# EAGLE design OPBS-Dynamo (EAGLE 6.4)
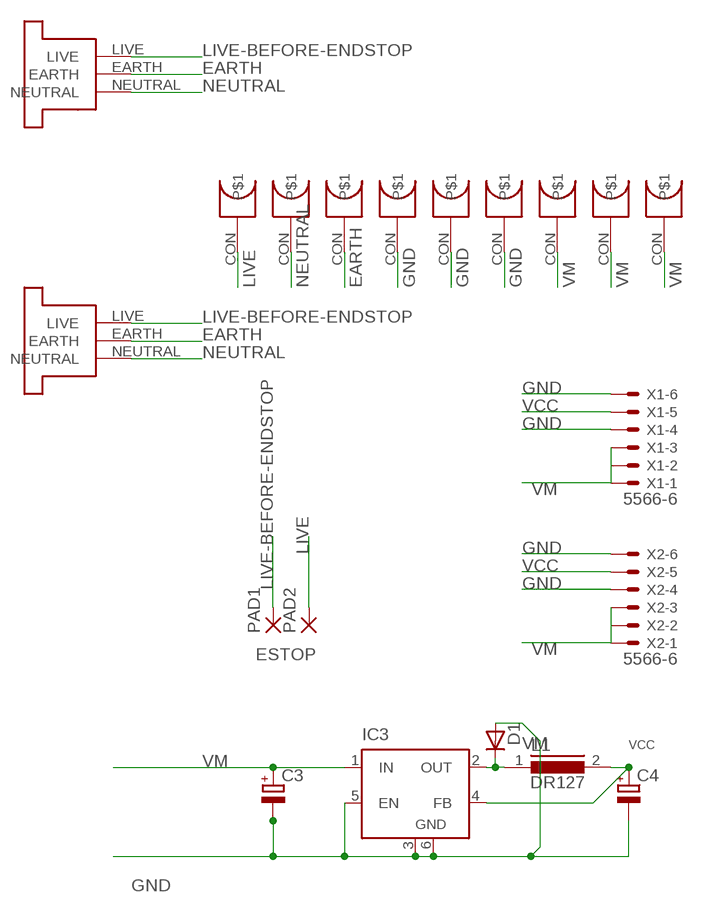
[diagram p0: schematic, sheet 1]

## Parts
C3  CPOL-EUE  [PANASONIC_E]
C4  CPOL-EUE  [PANASONIC_E]
D1  D-SOD-87  [SOD87]
EARTH  SLIDEINSCREW9.53  [SLIDEINSCREW]
GND1  SLIDEINSCREW9.53  [SLIDEINSCREW]
GND2  SLIDEINSCREW9.53  [SLIDEINSCREW]
GND3  SLIDEINSCREW9.53  [SLIDEINSCREW]
IC3  LM2596S  [TO263-5]
L1  DR127  [DR127]
LIVE  SLIDEINSCREW9.53  [SLIDEINSCREW]
NEUTRAL  SLIDEINSCREW9.53  [SLIDEINSCREW]
PAD1  3,81/1,4  [3,81/1,4]
PAD2  3,81/1,4  [3,81/1,4]
U$1  IEC320JR-101S  [IEC320-JR101S]
U$2  IEC320JR-101S  [IEC320-JR101S]
V1  SLIDEINSCREW9.53  [SLIDEINSCREW]
V2  SLIDEINSCREW9.53  [SLIDEINSCREW]
V3  SLIDEINSCREW9.53  [SLIDEINSCREW]
X1  5566-6  [5566-6]
X2  5566-6  [5566-6]

## Nets
EARTH: EARTH.CON U$1.EARTH U$2.EARTH
GND: C3.- C4.- D1.2(A) GND1.CON GND2.CON GND3.CON IC3.3(GND) IC3.5(EN) IC3.6(GND) X1.4 X1.6 X2.4 X2.6
LIVE: LIVE.CON PAD2.1(P)
LIVE-BEFORE-ENDSTOP: PAD1.1(P) U$1.LIVE U$2.LIVE
N$4: D1.1(C) IC3.2(OUT) L1.1
NEUTRAL: NEUTRAL.CON U$1.NEUTRAL U$2.NEUTRAL
VCC: C4.+ IC3.4(FB) L1.2 X1.5 X2.5
VM: C3.+ IC3.1(IN) V1.CON V2.CON V3.CON X1.1 X1.2 X1.3 X2.1 X2.2 X2.3

## Notes on the sheet
- ESTOP

## Library data of the parts
C3 C4 = resistor:CPOL-EU: POLARIZED CAPACITOR, European symbol
D1 = semicon-smd-ipc:D-: DIODE unfilled
EARTH GND1-GND3 LIVE NEUTRAL V1-V3 = PSUBoard-IECPlug:SLIDEINSCREW9.53
IC3 = linear:LM2596S: STEP-DOWN VOLTAGE REGULATOR
L1 = inductors:DR127: High Power Density, High Efficiency, Shielded Inductors Source: coiltronics_dr_series.pdf
PAD1 PAD2 = wirepad:3,81/1,4: THROUGH-HOLE PAD
U$1 U$2 = PSUBoard-IECPlug:IEC320JR-101S
X1 X2 = con-molex:5566-6: Mini FIT connector 6 pol Source: http://www.molex.com; MPN: 95566-61002; OC_FARNELL: unknown; OC_NEWARK: 22K8620

## Net classes
0 default: width 0.203 mm, drill 0.406 mm, clearance 0.203 mm

## Board
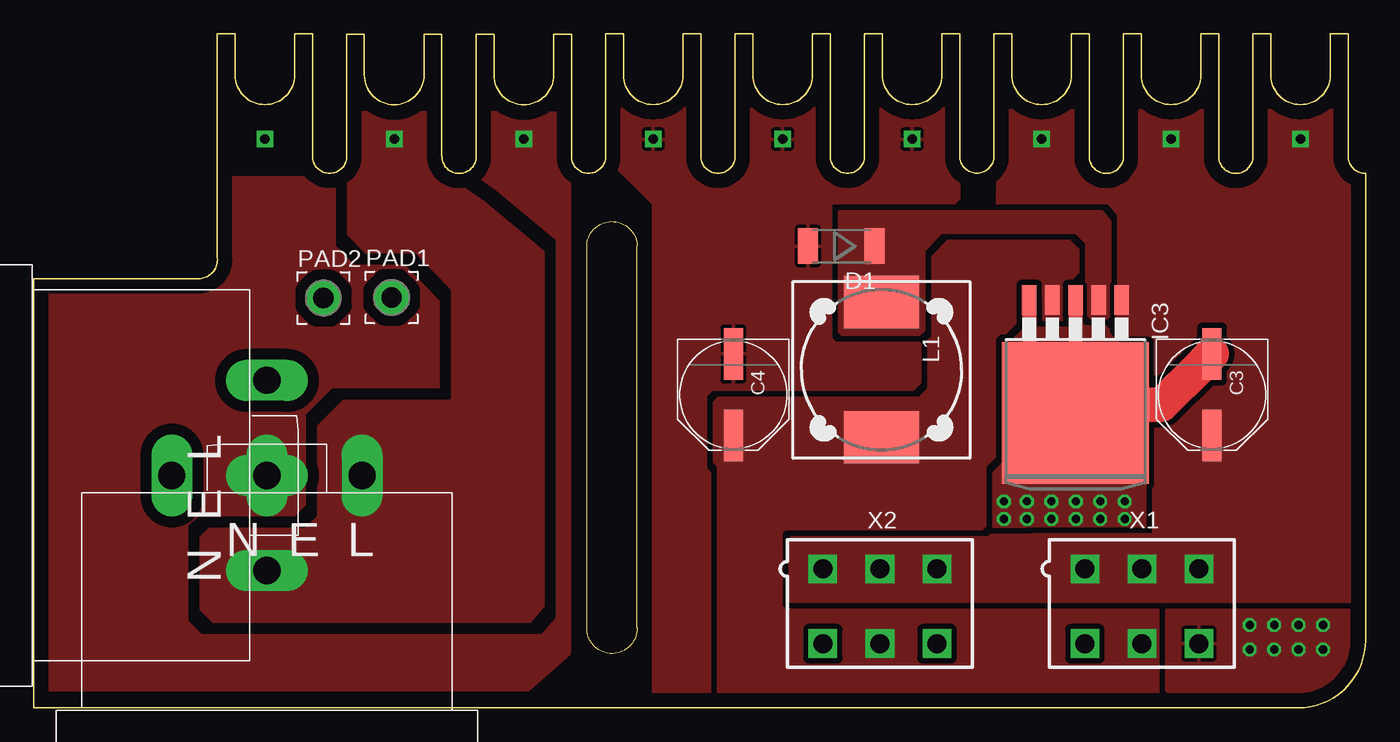
[diagram p1: board, top side]
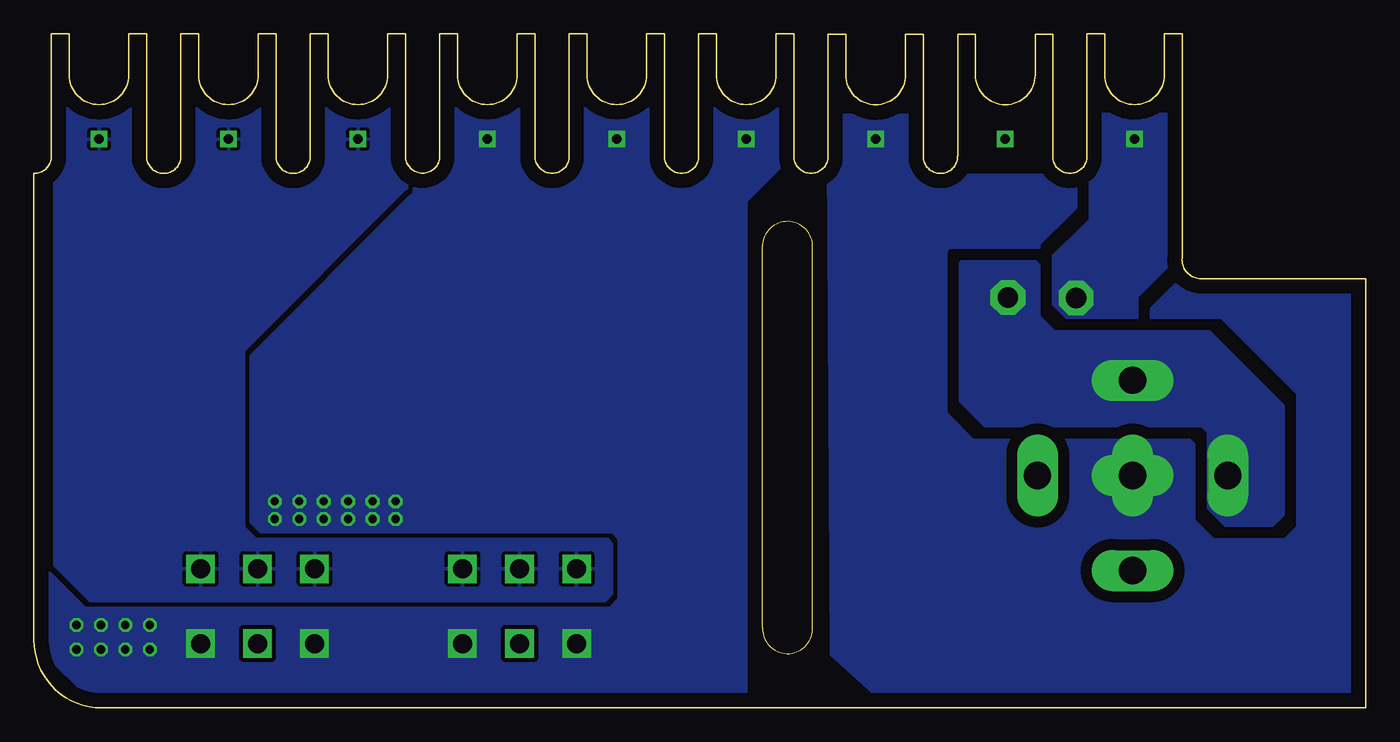
[diagram p2: board, bottom side, seen from below]

Size 98.03 x 49.6 mm. Coordinates in mm from the lower left corner, seen from the top.
Outline: 23.03,40.61 arc-180 20.5,40.61
Outline: 32.56,40.6 arc-180 30.03,40.6
Outline: 42.09,40.61 arc-180 39.56,40.61
Outline: 51.62,40.61 arc-180 49.09,40.61
Outline: 61.15,40.61 arc-180 58.62,40.61
Outline: 70.68,40.62 arc-180 68.15,40.62
Outline: 80.21,40.6 arc-180 77.68,40.6
Outline: 89.74,40.6 arc-180 87.21,40.6
Outline: 96.74,40.6 arc90 98.03,39.34 98.03,5 arc-90 93.06,0 0,0 0,31.6 12.24,31.6 arc90 13.5,33.13
Outline: 13.5,40.6 13.5,33.14
Outline: 40.7,33.9 arc-180 44.4,34 44.4,5.9 arc-180 40.7,5.8 40.7,33.9
Copper layers (1*16): Top 0.035mm / dielectric 1.5mm / Bottom 0.035mm
Design rules "default": minimum track width 10mil, minimum drill 24mil, track to track 8mil, track to pad 8mil, pad to pad 8mil, via to via 8mil, smd to smd 8mil, copper to edge 40mil, drill to drill 8mil, minimum pad ring 10mil, minimum via ring 8mil, stop-mask expansion 4mil, vias tented up to drill 0mil, thermal gap 10mil

### Footprints (pad centres in the part's own frame; a part is rotated, then mirrored left to right if it is on the bottom)
PANASONIC_E = smd 3.8 x 1.4: + 3,0; - -3,0
SOD87 = smd 1.45 x 2.6: 1 -2.445,0; 2 2.445,0
SLIDEINSCREW = drill 0.7 square: CON 0,-1.27
TO263-5 = smd 1.067 x 2.159: 1 -3.404,-5.791; 2 -1.702,-5.791; 3 0,-5.791; 4 1.702,-5.791; 5 3.404,-5.791 | smd 10.8 x 10.41: 6 0,2.54
DR127 = smd 3.85 x 5.5: 1 -4.975,0; 2 4.975,0
3,81/1,4 = drill 1.5 pad 2.54 octagon: 1 0,0
IEC320-JR101S = drill 2 long: EARTH 0,0; LIVE 7,0; NEUTRAL -7,0
5566-6 = drill 1.4 square: 1 4.2,-2.75; 2 0,-2.75; 3 -4.2,-2.75; 4 4.2,2.75; 5 0,2.75; 6 -4.2,2.75

### Placement (x,y rotation side)
C3  86.73,23.05 270 top
C4  51.49,23.05 270 top
D1  59.43,33.99 180 top
EARTH  36.06,40.59 180 top
GND1  45.59,40.6 180 top
GND2  55.12,40.6 180 top
GND3  64.65,40.6 180 top
IC3  76.67,24.24 180 top
L1  62.39,24.89 270 top
LIVE  17,40.6 180 top
NEUTRAL  26.52,40.59 180 top
PAD1  26.33,30.21 0 top
PAD2  21.31,30.16 0 top
U$1  17.15,17.11 90 top
U$2  17.15,17.11 180 top
V1  74.18,40.6 180 top
V2  83.71,40.6 180 top
V3  93.24,40.6 180 top
X1  81.57,7.49 180 top
X2  62.28,7.48 180 top

### Tracks (layer width: path | path; a pad name or v marks a point on that pad's centre or on a via)
EARTH
  pour Bottom (isolate 0.813, rank 3, no thermals): 12.45,31.58 13.56,32.69 13.52,39.28 32.85,39.28 32.85,43.55 33.01,43.71 39.18,43.71 39.37,43.52 39.6,40.53 39.4,3.9 35.1,0 0,0 0,31.58
  pour Top (isolate 0.813, rank 5, no thermals): 32.47,43.92 31.5,43.92 31.5,39.1 2.51,39.1 2.51,39.03 0.05,38.05 -0.33,1.26 36.4,1.26 39.5,4 39.5,43.45 39.4,43.85
GND  (via drill 0.6)
  Top 1.016: IC3.3 76.67,22.4 IC3.6 73.27,25.1 IC3.5
  Top 2.54: C3.- 85.93,25.23 83,22.3 76.77,22.3 76.67,22.4
  other vias: 71.4,15.2 73.1,15.2 74.9,15.2 76.7,15.2 78.5,15.2 80.3,15.2 71.4,13.9 73.1,13.9 74.9,13.9 76.7,13.9 78.5,13.9 80.3,13.9 89.5,6.1 91.3,6.1 93.1,6.1 94.9,6.1 94.9,4.3 93.1,4.3 91.3,4.3 89.5,4.3
  pour Bottom (isolate 0.305, rank 6, no thermals): 42.1,49.7 42.1,40.8 45.2,37.7 45.6,37.3 45.6,0.3 93.5,0.3 97.7,4.5 97.7,38.8 96.5,40 68.5,40 68,40.5 68,49.7
  pour Top (isolate 0.406, rank 3): 68.1,49.5 68.1,37.5 67.6,37 59.1,37 58.8,36.7 58.8,27.5 59.3,27 65,27 65.4,26.6 65.4,23.8 64.9,23.3 50.2,23.3 49.6,22.7 49.6,17.8 49.9,17.5 49.9,1.2 45.6,1.2 45.6,37.1 42.2,40.5 42.2,49.6 68,49.6
  pour Top (isolate 0.406, rank 6, no thermals): 70.5,13.3 81.9,13.3 81.9,26.7 81.8,26.8 80.1,26.8 78.9,28 77.7,28 77.3,28.4 77.2,28.5 77.2,31 77.1,31.1 76.2,31.1 76.1,31 76.1,28.4 75.9,28.2 74,28.2 73.8,28.4 73.8,31 73.7,31.1 72.7,31.1 72.6,31 72.6,27.9 71.8,27.1 71.3,27.1 71.1,26.9 71.1,18.2 70.5,17.6
  pour Top (isolate 0.305): 83.4,7.2 96.8,7.2 96.8,2.9 95.2,1.3 95.1,1.3 94.9,1.1 83.6,1.1 83.4,1.3
LIVE
  pour Bottom (isolate 0.813, rank 2, no thermals): 13.88,43.77 20.11,43.77 20.35,43.53 20.35,35.93 23.48,32.8 23.48,28.13 23.09,28.74 17.13,27.74 16.76,28.11 16.76,30.27 14.61,32.42 13.81,32.42 13.69,32.54 13.69,43.58
LIVE-BEFORE-ENDSTOP
  pour Bottom (isolate 0.813, no thermals): 12.37,27.76 22.91,27.76 23.97,28.82 23.97,32.59 24.28,32.9 29.74,32.9 29.91,32.73 29.91,22.59 28.01,20.69 12.04,20.69 11.65,20.3 11.65,14.7 10.34,13.39 6.82,13.39 5.99,14.22 5.99,22.23 11.54,27.78
N$4
  pour Top (isolate 0.305, no thermals): 79,28.7 77.8,28.7 77.5,29 77.5,34.2 76.7,35 66.8,35 65.5,33.7 65.5,27.8 65.2,27.5 59.5,27.5 59.3,27.7 59.3,36.5 78.6,36.5 79.2,35.8 79.2,28.9
NEUTRAL
  pour Top (isolate 0.813, no thermals): 23.41,43.86 29.41,43.86 29.79,43.48 29.79,39.93 30.83,38.89 33.18,37.2 37.54,33.57 37.54,7.49 36.52,6.32 13.19,6.32 12.23,7.28 12.23,12.55 12.92,13.24 20.08,13.26 20.9,14.08 20.9,20.74 22.84,22.68 30.62,22.64 30.76,22.64 30.76,30.8 28.13,33.51 24.42,33.51 23.08,34.85 23.08,43.53
VCC
  pour Top (isolate 0.406, rank 2, no thermals): 75.7,28.6 74.3,28.6 74.1,28.8 74.1,31.4 73.9,31.6 72.5,31.6 72.2,31.3 72.2,28.3 71.5,27.6 71.1,27.6 70.7,27.2 70.7,18.5 70,17.8 70,13.4 69.8,13.2 55.3,13.2 55,12.9 55,7.5 55.3,7.2 83,7.2 83,1.2 50.4,1.2 50.4,17.8 50.1,18.1 50.1,22.5 50.4,22.8 65.2,22.8 65.9,23.5 65.9,33.5 67,34.6 76.4,34.6 77,34 77,32.2 76.3,31.5 75.8,31.5 75.7,31.4
VM
  pour Top (isolate 0.406, rank 3, no thermals): 71.1,49.8 96.4,49.8 96.3,42.8 96.3,40.2 97.7,38.8 97.7,7.7 55.4,7.7 55.5,12.6 82.5,12.7 82.5,26.8 81.8,27.5 80.4,27.5 79.6,28.3 79.6,36 78.8,37 71,37 71.1,43.5
  pour Bottom (isolate 0.305, rank 5): 70.5,49.6 96.3,49.6 96.5,49.4 96.5,10.5 93.9,7.9 56,7.9 55.5,8.4 55.5,12.1 55.8,12.4 81.7,12.4 82.6,13.3 82.6,26.3 71,37.9 70.6,38.3 70.6,49.5

### Text on the board
OHSILK: L | N | E | - | - | - | + | + | + | E-STOP | + | + | + | + | + | + | 5v | 5v | - | - | - | -